# EAGLE design HL_gas_o3_pcb (EAGLE 9.1.3)
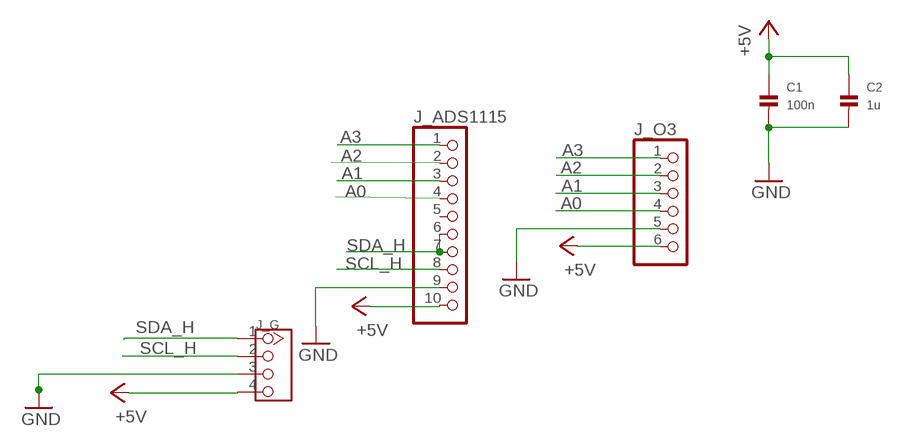
[diagram p0: schematic, sheet 1]

## Parts
C1  100n  CAP_CERAMIC1206  [1206]
C2  1u  CAP_CERAMIC1206  [1206]
J_ADS1115  HEADER-1X10  [1X10_OVAL]
J_G  TWIG-4P-2.0-2.0  [4P-2.0]
J_O3  HEADER-1X6  [1X06_OVAL]

## Nets
+5V [power]: C1.1 C2.1 J_ADS1115.10 J_G.4 J_O3.6
A0: J_ADS1115.4 J_O3.4
A1: J_ADS1115.3 J_O3.3
A2: J_ADS1115.2 J_O3.2
A3: J_ADS1115.1 J_O3.1
GND [power]: C1.2 C2.2 J_ADS1115.9 J_G.3 J_O3.5
SCL_H: J_ADS1115.8 J_G.2
SDA_H: J_ADS1115.6 J_ADS1115.7 J_G.1
Unconnected: J_ADS1115.5

## Library data of the parts
C1 C2 = microbuilder:CAP_CERAMIC: Ceramic Capacitors 0402 - 0402 Surface Mount Capacitors 16pF 50V 5% [Digikey: 445-4899-2-ND] 18pF 50V 5% [Digikey: 490-1281-2-ND] 22pF 50V 5% [Digikey: 490-1283-2-ND] 68pF 50V 5% [Digikey: 490-1289-2-ND] 0.1uF 10V 10% [Digikey: 490-1318-2-ND] 1.0uF 6.3V 10% [Digikey: 490-1320-2-ND] 0603 - 0603 Surface Mount Capacitors 16 pF 50V 5% [Digikey: 445-5051-2-ND] 22 pF 50V [Digikey: PCC220ACVTR-ND] 33 pF 50V 5% [Digikey: 490-1415-1-ND] 56pF 50V 5% [Digikey: 490-1421-1-ND] 220pF 50V 5% [Digikey: 445-1285-1-ND] 680 pF 50V 2200 pF 50V 5% C0G [Digikey: 445-1297-1-ND] 5600 pF 100V 5% X7R [Digikey: 478-3711-1-ND] 0.1 µF 25V 10% [Digikey: PCC2277TR-ND] 0.22 µF 16V 10% X7R [Digikey: 445-1318-1-ND] 1.0 µF 25V 10% [Digikey: 445-5146-2-ND] 0603 - RF Specific 3pF 250V +/-0.1pF RF [Digikey: 712-1347-1-ND] 18 pF 250V 5% [Digikey: 478-3505-1-ND or 712-1322-1-ND] 56 pF 250V 5% C0G RF [Digikey: 490-4867-1-ND] 68 pF 250V RF [Digikey: 490-4868-1-ND] 0805 - 0805 Surface Mount Capacitors 220 pF 250V 2% RF Ceramic Capacitor [Digikey: 712-1398-1-ND] 1000 pF 50V 2% NP0 Ceramic Capacitor [Digikey: 478-3760-1-ND] 0.1 µF 25V 10% Ceramic Capacitor [Digikey: PCC1828TR-ND] 1.0 µF 16V 10% Ceramic Capacitor[Digikey: 490-1691-2-ND] 10.0 µF 10V 10% Ceramic Capacitor[Digikey: 709-1228-1-ND] 10.0 uF 16V 10% Ceramic Capacitor [Digikey: 478-5165-2-ND] 47 uF 6.3V 20% Ceramic Capacitor [Digikey: 587-1779-1-ND or 399-5506-1-ND] 1206 - 1206 Surface Mount Capacitors 47uF 10V 20% Ceramic Capacitor [Digikey: 490-5528-1-ND or 399-5508-1-ND or 445-6010-1-ND] 100uF 6.3V -20%, +80% Y5V Ceramic Capacitor (Digikey: 490-4512-1-ND, Mouser: 81-GRM31CF50J107ZE1L)
J_ADS1115 = microbuilder:HEADER-1X10: PIN HEADER
J_G = Connector:TWIG-4P-2.0
J_O3 = microbuilder:HEADER-1X6: PIN HEADER

## Net classes
0 default: width 0.3 mm, drill 0.8 mm, clearance 0.4 mm
1 power: width 0.8 mm, drill 0.8 mm, clearance 0.4 mm

## Board
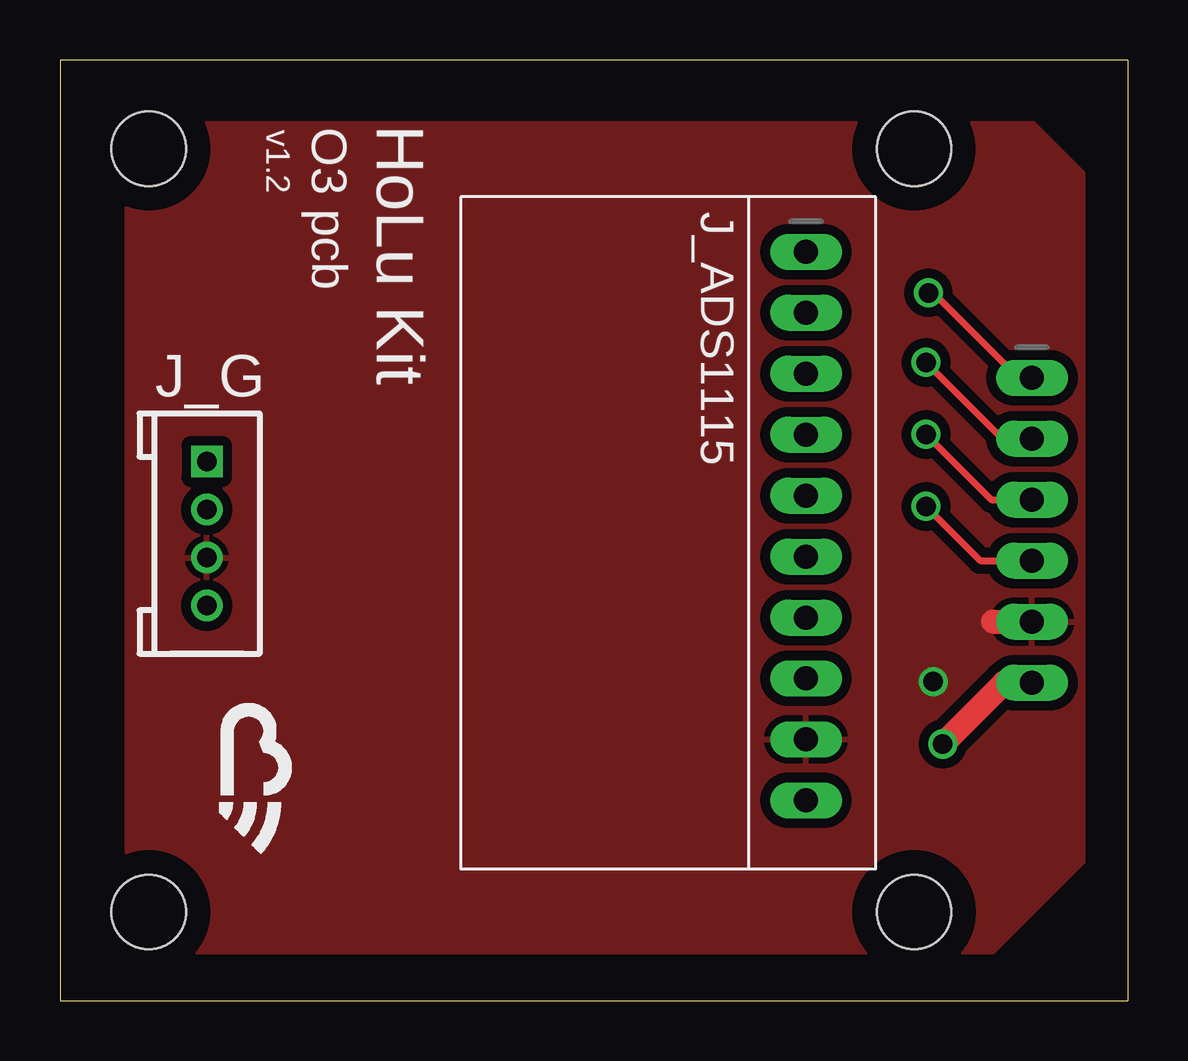
[diagram p1: board, top side]
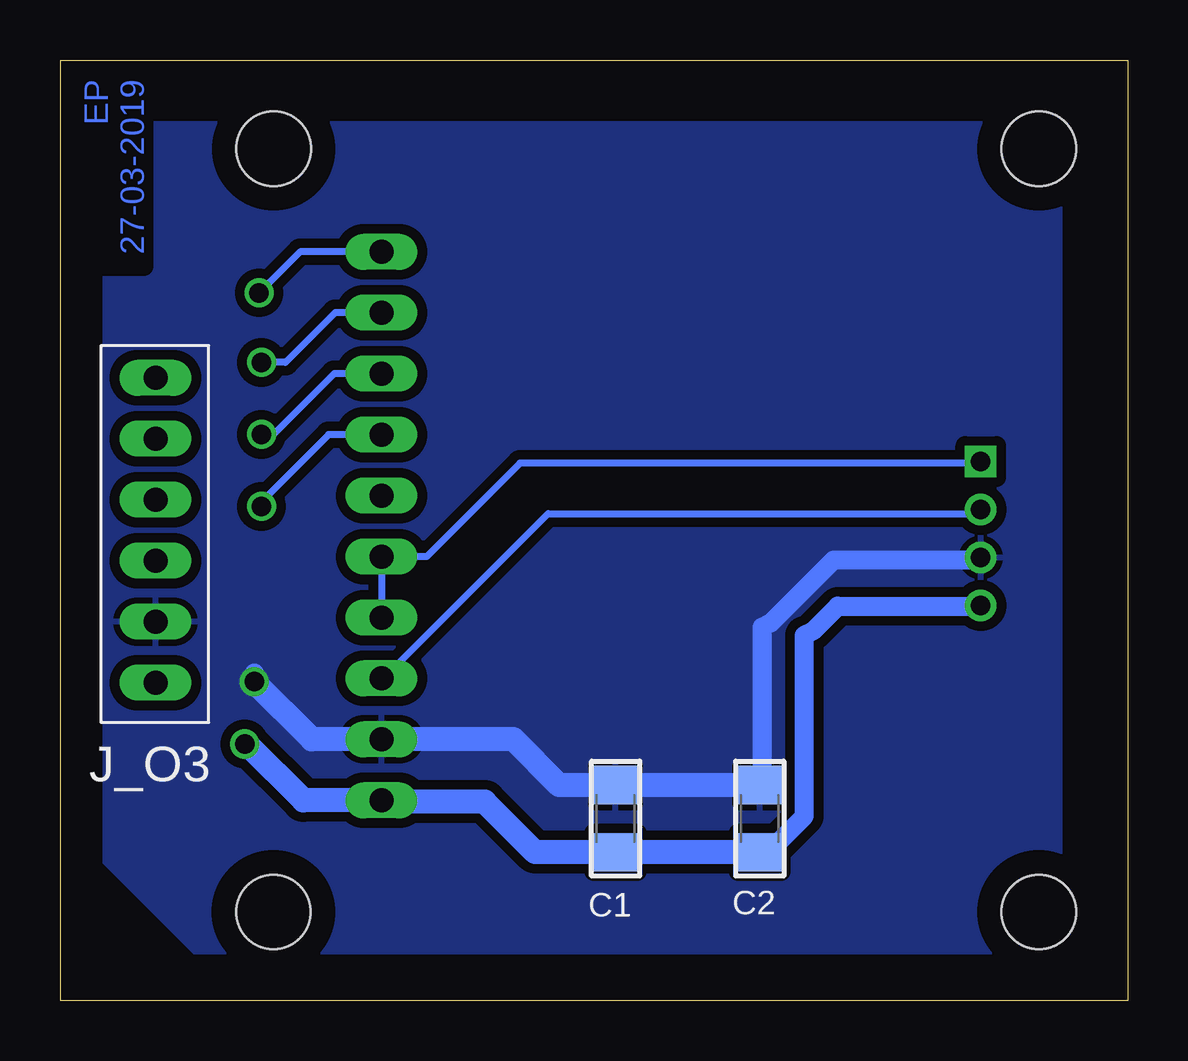
[diagram p2: board, bottom side, seen from below]

Size 44.5 x 39.2 mm. Coordinates in mm from the lower left corner, seen from the top.
Outline: 0,0 44.5,0 44.5,39.2 0,39.2 0,0
Copper layers (1*16): Top 0.035mm / dielectric 1.5mm / Bottom 0.035mm
Design rules "default": minimum track width 6mil, minimum drill 0.35mm, track to track 6mil, track to pad 6mil, pad to pad 6mil, via to via 6mil, smd to smd 6mil, copper to edge 40mil, drill to drill 6mil, minimum pad ring 10mil, minimum via ring 8mil, stop-mask expansion 4mil, vias tented up to drill 0mil, thermal gap 10mil
Holes 3.1 mm at 35.6,35.5 3.7,35.5 35.61,3.7 3.7,3.7

### Footprints (pad centres in the part's own frame; a part is rotated, then mirrored left to right if it is on the bottom)
1206 = smd 1.6 x 1.8: 1 -1.4,0; 2 1.4,0
1X10_OVAL = drill 1 long: 1 -11.43,0; 2 -8.89,0; 3 -6.35,0; 4 -3.81,0; 5 -1.27,0; 6 1.27,0; 7 3.81,0; 8 6.35,0; 9 8.89,0; 10 11.43,0
4P-2.0 = drill 0.813 pad 1.27 square: 1 -3,0 | drill 0.813 pad 1.27: 2 -1,0; 3 1,0; 4 3,0
1X06_OVAL = drill 1 long: 1 -6.35,0; 2 -3.81,0; 3 -1.27,0; 4 1.27,0; 5 3.81,0; 6 6.35,0

### Placement (x,y rotation side)
C1  21.34,7.59 90 bottom
C2  15.33,7.59 90 bottom
J_ADS1115  31.1,19.78 270 top
J_G  6.12,19.47 270 top
J_O3  40.52,19.61 270 top

### Tracks (layer width: path | path; a pad name or v marks a point on that pad's centre or on a via)
+5V  (via drill 0.81)
  Top 1: v36.8,10.7 39.36,13.26 J_O3.6
  Bottom 0.8: C2.1 14.88,6.3 13.47,7.7 13.47,15.22 13.12,15.4 12.07,16.45 6.12,16.45 J_G.4
  Bottom 1: C2.1 C1.1 24.69,6.19 26.8,8.3 31.05,8.3 J_ADS1115.10 34.35,8.35 36.7,10.7 v36.8,10.7
A0  (via drill 0.81)
  Top 0.3: v36.1,20.6 38.36,18.34 J_O3.4
  Bottom 0.3: J_ADS1115.4 33.31,23.59 36.2,20.7 v36.1,20.6
A1  (via drill 0.81)
  Top 0.3: v36.1,23.6 38.82,20.88 J_O3.3
  Bottom 0.3: J_ADS1115.3 33.07,26.13 35.6,23.6 v36.1,23.6
A2  (via drill 0.81)
  Top 0.3: v36.1,26.6 39.28,23.42 J_O3.2
  Bottom 0.3: J_ADS1115.2 33.03,28.67 35.1,26.6 v36.1,26.6
A3  (via drill 0.81)
  Top 0.3: v36.2,29.5 36.4,29.5 39.94,25.96 J_O3.1
  Bottom 0.3: J_ADS1115.1 34.49,31.21 v36.2,29.5
GND  (via drill 0.81)
  Top 1: 38.9,15.8 J_O3.5
  Bottom 0.8: C2.2 15.22,9.45 15.22,15.57 14.88,15.75 12.25,18.38 6.12,18.38 J_G.3 | 36.4,13.65 v36.4,13.3
  Bottom 1: C2.2 C1.2 23.69,8.99 25.6,10.9 J_ADS1115.9 33.99,10.89 v36.4,13.3
  pour Top: 9.3,2 38.9,2 42.67,5.77 42.67,34.5 40.6,36.58 5.75,36.58 2.76,33.59 2.76,4.69 4.74,2.71 5.45,2
  pour Bottom: 38.9,2 42.04,5.14 42.65,5.75 42.65,10.9 42.65,34.61 41.7,35.57 40.69,36.58 28.86,36.58 5.73,36.58 3.77,34.61 2.78,33.62 2.78,24.88 2.78,4.67 5.31,2.13 5.45,2 5.83,2
SCL_H
  Bottom 0.3: 30.98,13.47 J_ADS1115.8 30.98,13.47 | 30.98,13.47 24.15,20.3 6.12,20.3 J_G.2
SDA_H
  Bottom 0.3: J_ADS1115.7 30.98,15.93 31.1,16.05 J_ADS1115.6 29.21,18.51 25.32,22.4 6.12,22.4 J_G.1

### Text on the board
Bottom: EP / 27-03-2019
tPlace: v1.2 | O3 pcb | HoLu Kit
tDocu: Designed by Stichting Waag Society / / / Released under the Creative Commons Attribution Share-Alike 4.0 Licence / https://creativecommons.org/licenses/by-sa/4.0/